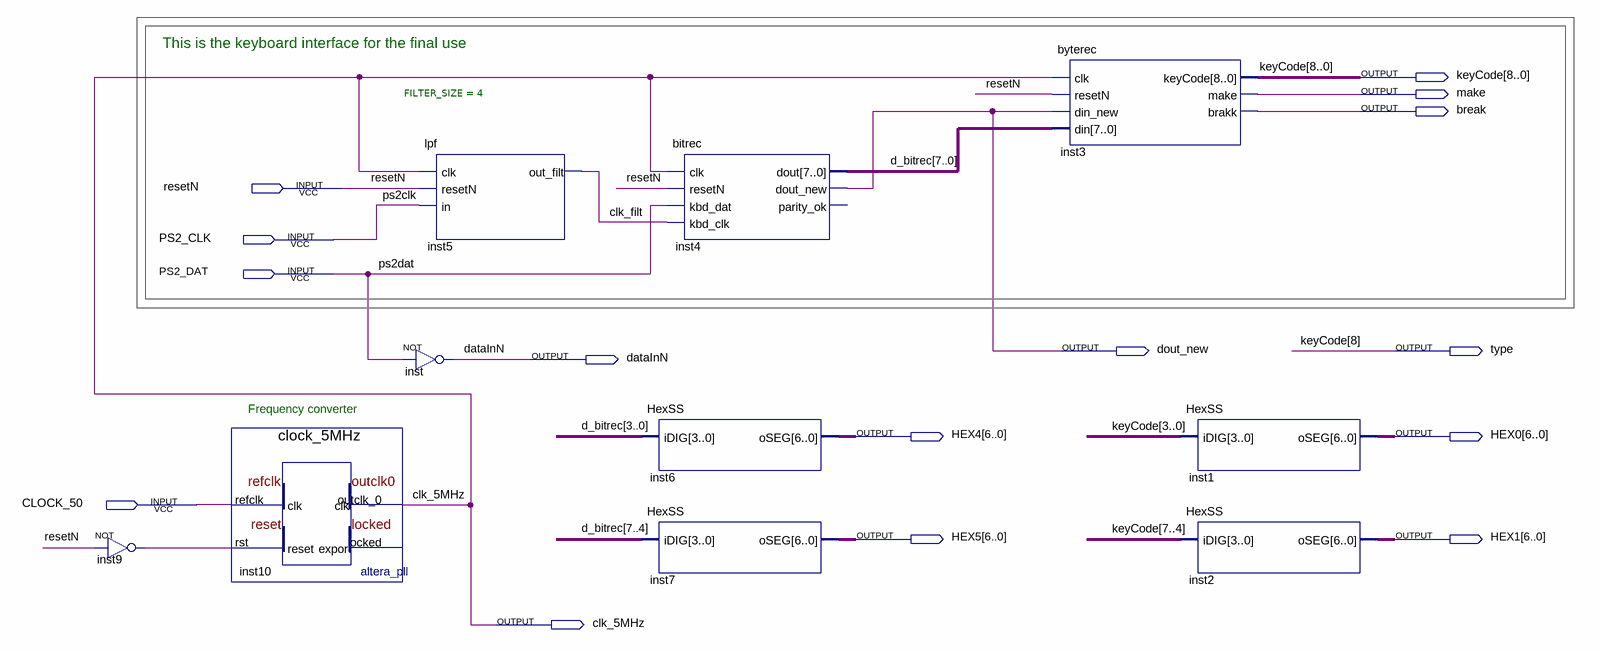
[diagram p0: schematic sheet]
// Quartus schematic TOP_KBDINTF.bdf as structural Verilog: 10 symbols, 15 pins
module TOP_KBDINTF (
  input  resetN,
  input  PS2_CLK,
  input  PS2_DAT,
  input  CLOCK_50,
  output [8:0] keyCode,
  output make,
  output \break ,
  output dout_new,
  output \type ,
  output dataInN,
  output [6:0] HEX4,
  output [6:0] HEX0,
  output [6:0] HEX5,
  output [6:0] HEX1,
  output clk_5MHz
);

  wire clk_filt, inst9_out;
  wire [7:0] d_bitrec;

  not inst9 (inst9_out, resetN);
  clock_5MHz inst10 (.refclk(CLOCK_50), .rst(inst9_out), .outclk_0(clk_5MHz));  // open: locked
  lpf #(.FILTER_SIZE(4)) inst5 (.clk(clk_5MHz), .resetN(resetN), .in(PS2_CLK), .out_filt(clk_filt));
  not inst (dataInN, PS2_DAT);
  bitrec inst4 (
    .clk(clk_5MHz), .resetN(resetN), .kbd_dat(PS2_DAT), .kbd_clk(clk_filt), .dout(d_bitrec),
    .dout_new(dout_new));  // open: parity_ok
  HexSS inst6 (.iDIG(d_bitrec[3:0]), .oSEG(HEX4));
  HexSS inst7 (.iDIG(d_bitrec[7:4]), .oSEG(HEX5));
  byterec inst3 (
    .clk(clk_5MHz), .resetN(resetN), .din_new(dout_new), .din(d_bitrec), .keyCode(keyCode), .make(make),
    .brakk(\break ));
  HexSS inst1 (.iDIG(keyCode[3:0]), .oSEG(HEX0));
  HexSS inst2 (.iDIG(keyCode[7:4]), .oSEG(HEX1));

  assign \type  = keyCode[8];

  // Other names for the same wires on the sheet: ps2dat = PS2_DAT; ps2clk = PS2_CLK

  // Notes on the sheet:
  //   This is the keyboard interface for the final use 
  //   Frequency converter 
endmodule
